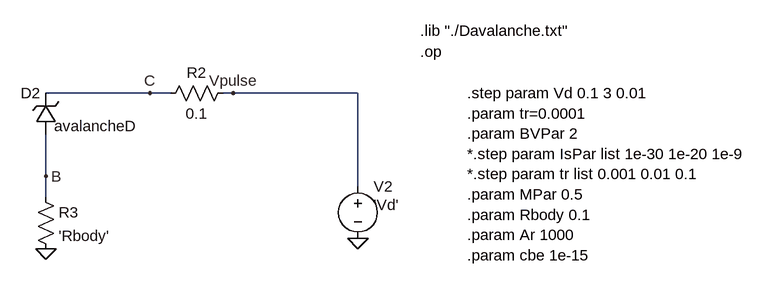
[diagram p0: schematic Davalanche_debug.asc]
Davalanche_debug.asc, the LTspice schematic file:
Version 4
SHEET 1 1252 680
WIRE 288 144 128 144
WIRE 320 144 288 144
WIRE 416 144 400 144
WIRE 608 144 416 144
WIRE 128 272 128 208
WIRE 608 288 608 144
WIRE 128 304 128 272
FLAG 128 272 B
FLAG 416 144 Vpulse
FLAG 608 368 0
FLAG 128 384 0
FLAG 288 144 C
SYMBOL res 416 128 R90
WINDOW 0 0 56 VBottom 2
WINDOW 3 32 56 VTop 2
SYMATTR InstName R2
SYMATTR Value 0.1
SYMBOL voltage 608 272 R0
WINDOW 3 24 44 Left 2
WINDOW 123 0 0 Left 0
WINDOW 39 0 0 Left 0
SYMATTR Value 'Vd'
SYMATTR InstName V2
SYMBOL res 112 288 R0
SYMATTR InstName R3
SYMATTR Value 'Rbody'
SYMBOL zener 144 208 R180
WINDOW 0 24 64 Left 2
WINDOW 3 -124 13 Left 2
SYMATTR InstName D2
SYMATTR Value avalancheD
SYMATTR SpiceLine area=0.05
TEXT 704 48 Left 2 !.lib "./Davalanche.txt"
TEXT 704 80 Left 2 !.op
TEXT 776 144 Left 2 !.step param Vd 0.1 3 0.01\n.param tr=0.0001\n.param BVPar 2\n*.step param IsPar list 1e-30 1e-20 1e-9\n*.step param tr list 0.001 0.01 0.1\n.param MPar 0.5\n.param Rbody 0.1\n.param Ar 1000\n.param cbe 1e-15

The netlist it stands for:
* Davalanche_debug.asc
R2 Vpulse C 0.1
V2 Vpulse 0 'Vd'
R3 B 0 'Rbody'
D2 B C avalancheD area=0.05
.model D D
.lib standard.dio
.lib "./Davalanche.txt"
.op
.step param Vd 0.1 3 0.01
.param tr=0.0001
.param BVPar 2
*.step param IsPar list 1e-30 1e-20 1e-9
*.step param tr list 0.001 0.01 0.1
.param MPar 0.5
.param Rbody 0.1
.param Ar 1000
.param cbe 1e-15
.backanno
.end